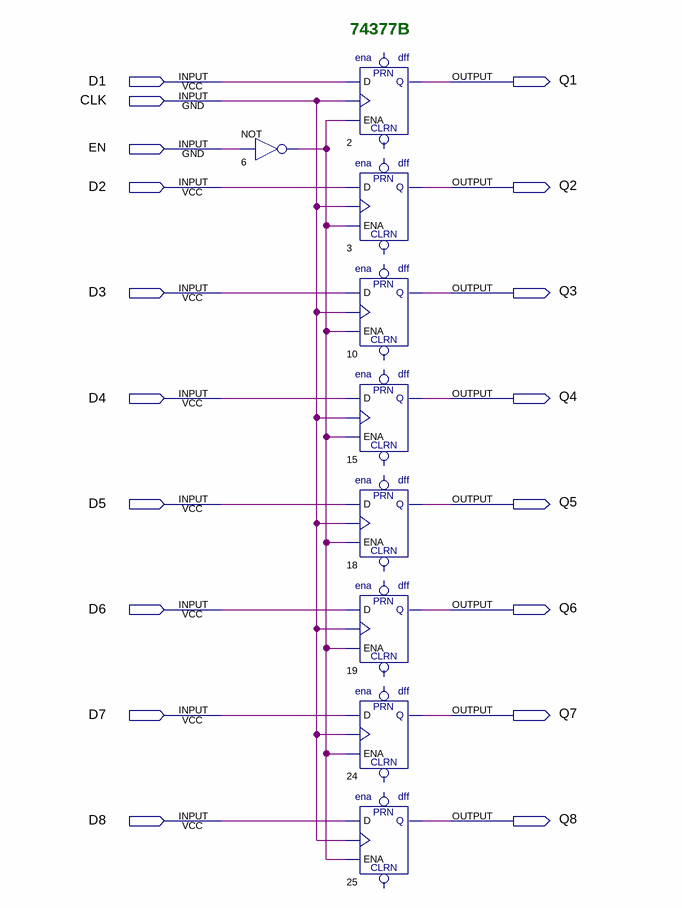
[diagram p0: schematic sheet]
// Quartus schematic 74377b.bdf as structural Verilog: 9 symbols, 18 pins
module \74377b  (
  input  D1,
  input  CLK,
  input  EN,
  input  D2,
  input  D3,
  input  D4,
  input  D5,
  input  D6,
  input  D7,
  input  D8,
  output Q1,
  output Q2,
  output Q3,
  output Q4,
  output Q5,
  output Q6,
  output Q7,
  output Q8
);

  wire n6_out;

  not u_6 (n6_out, EN);
  enadff u_2 (.ENA(n6_out), .D(D1), .CLK(CLK), .Q(Q1));  // open: PRN, CLRN
  enadff u_3 (.ENA(n6_out), .D(D2), .CLK(CLK), .Q(Q2));  // open: PRN, CLRN
  enadff u_10 (.ENA(n6_out), .D(D3), .CLK(CLK), .Q(Q3));  // open: PRN, CLRN
  enadff u_15 (.ENA(n6_out), .D(D4), .CLK(CLK), .Q(Q4));  // open: PRN, CLRN
  enadff u_18 (.ENA(n6_out), .D(D5), .CLK(CLK), .Q(Q5));  // open: PRN, CLRN
  enadff u_19 (.ENA(n6_out), .D(D6), .CLK(CLK), .Q(Q6));  // open: PRN, CLRN
  enadff u_24 (.ENA(n6_out), .D(D7), .CLK(CLK), .Q(Q7));  // open: PRN, CLRN
  enadff u_25 (.ENA(n6_out), .D(D8), .CLK(CLK), .Q(Q8));  // open: PRN, CLRN

  // Notes on the sheet:
  //   74377B
endmodule
